# Altium schematic sheet Power.SchDoc: Power Management (part 1 of 3)
size Letter; Author: Parth Thakkar; CompanyName: Insane Corp; Organization: Low Self Esteam; Revision: v1.0; SheetNumber: 5; SheetTotal: 8
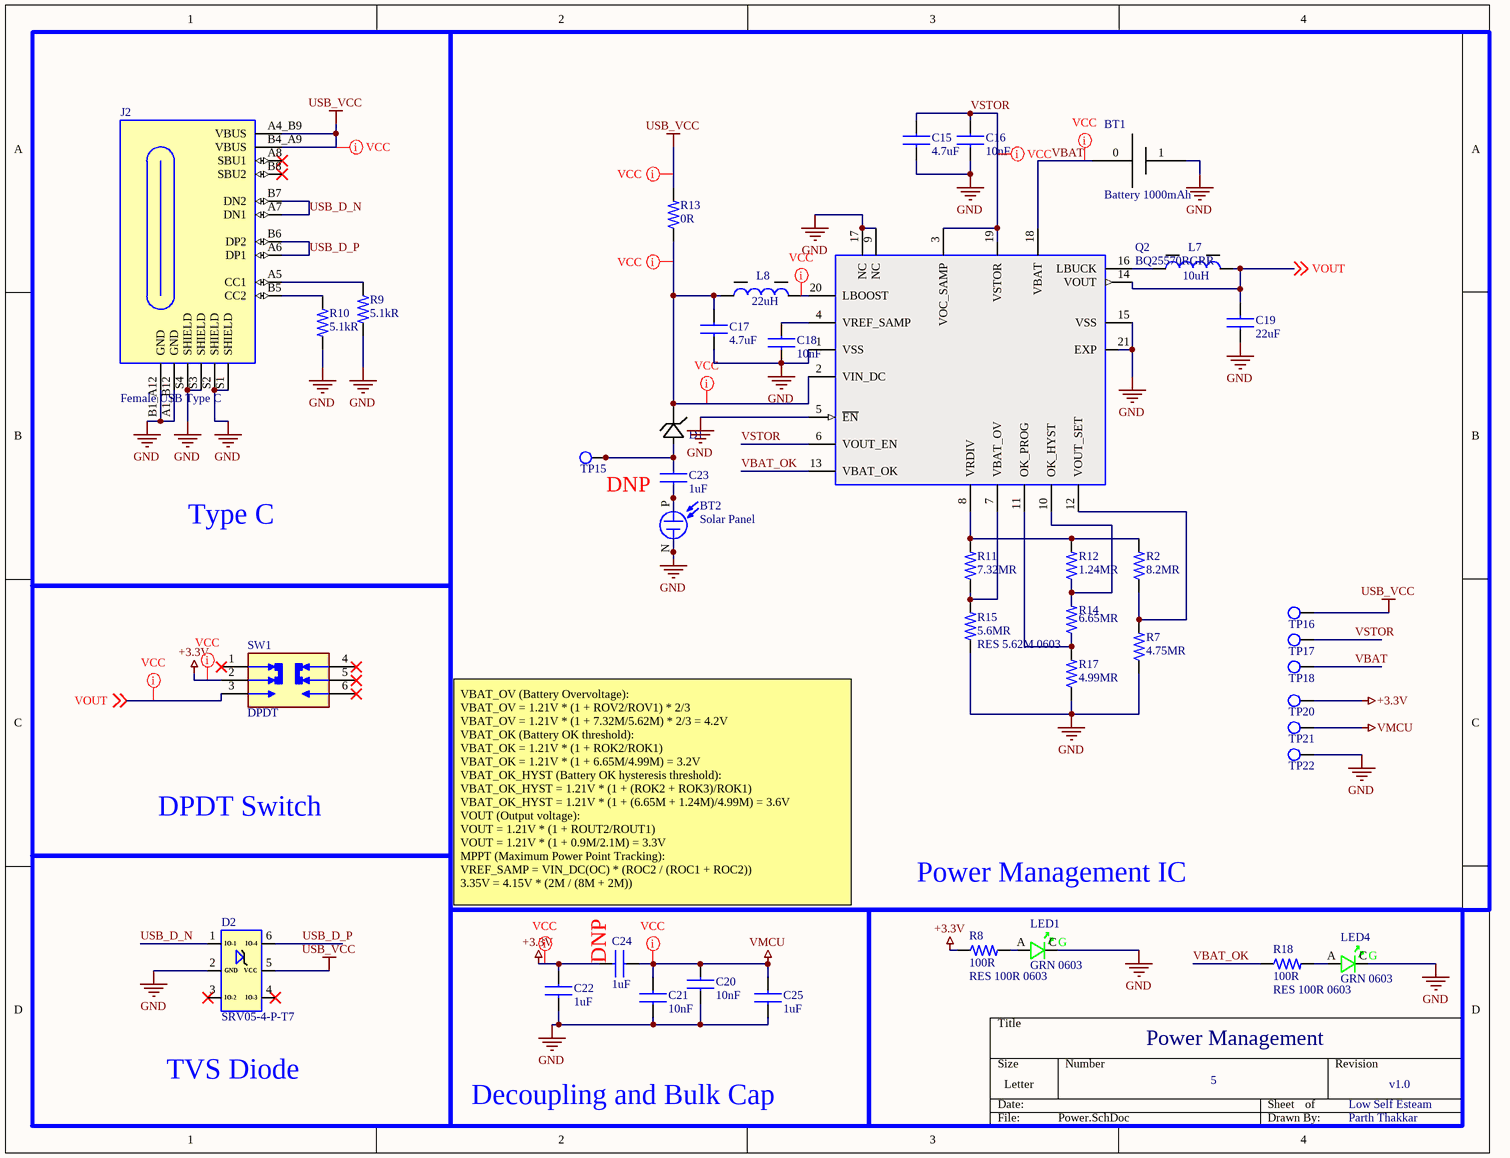
[diagram p0: Power.SchDoc]

## Parts
BT1  Battery 1000mAh  [Battery]
BT2  Solar Panel  [Solar panel]
C15  value 4.7uF  [Capacitor 0603]  (hidden comment: CAP 4.7uF 25V 0603)
C16  value 10nF  [Capacitor 0603]  (hidden comment: CAP 10nF 100V 0603)
C17  value 4.7uF  [Capacitor 0603]  (hidden comment: CAP 4.7uF 25V 0603)
C18  value 10nF  [Capacitor 0603]  (hidden comment: CAP 10nF 100V 0603)
C19  value 22uF  [Capacitor 0603]  (hidden comment: 22uF 10V X5R 0603)
C20  value 10nF  [Capacitor 0603]  (hidden comment: CAP 0.1uF 100V 0603)
C21  value 10nF  [Capacitor 0603]  (hidden comment: CAP 0.1uF 100V 0603)
C22  value 1uF  [CAPACITOR 0805]  (hidden comment: CAP 47uF 10V 0805)
C23  value 1uF  [CAPACITOR 0805]  (hidden comment: CAP 47uF 10V 0805)
C24  value 1uF  [CAPACITOR 0805]  (hidden comment: CAP 47uF 10V 0805)
C25  value 1uF  [CAPACITOR 0805]  (hidden comment: CAP 47uF 10V 0805)
D1  Diode Schottky  [Diode Schottky]  (value not drawn)
D2  SRV05-4-P-T7  [TVS]
J2  Female USB Type C  [Type C]
L7  Inductance-Nom (L): 10uH  [IND 10uH (1x3.2)]  (hidden comment: IND 10uH 1111)
L8  Inductance-Nom (L): 22uH  [IND 22uH (1.6x4.3)]  (hidden comment: IND 22uH 1515)
LED1  GRN 0603  [LED 0603]
LED4  GRN 0603  [LED 0603]
Q2  BQ25570RGRR  [BQ25570RGRR]
R2  value 8.2MR  [Resistor 0603]  (hidden comment: RES 8.2M 0603)
R7  value 4.75MR  [Resistor 0603]  (hidden comment: RES 4.75M 0603)
R8  RES 100R 0603  value 100R  [Resistor 0603]
R9  value 5.1kR  [Resistor 0603]  (hidden comment: RES 5.1K 0603)
R10  value 5.1kR  [Resistor 0603]  (hidden comment: RES 5.1K 0603)
R11  value 7.32MR  [Resistor 0603]  (hidden comment: RES 7.32M 0603)
R12  value 1.24MR  [Resistor 0603]  (hidden comment: RES 1.24M 0603)
R13  value 0R  [Resistor 0402]  (hidden comment: RES 0R 0402)
R14  value 6.65MR  [Resistor 0603]  (hidden comment: RES 6.65M 0603)
R15  RES 5.62M 0603  value 5.6MR  [Resistor 0603]
R17  value 4.99MR  [Resistor 0603]  (hidden comment: RES 4.99M 0603)
R18  RES 100R 0603  value 100R  [Resistor 0603]
SW1  DPDT  [DPDT]
TP15  Test point  [Test Point]  (value not drawn)  (net tie, no BOM)
TP16  Test point  [Test Point]  (value not drawn)  (net tie, no BOM)
TP17  Test point  [Test Point]  (value not drawn)  (net tie, no BOM)
TP18  Test point  [Test Point]  (value not drawn)  (net tie, no BOM)
TP20  Test point  [Test Point]  (value not drawn)  (net tie, no BOM)
TP21  Test point  [Test Point]  (value not drawn)  (net tie, no BOM)
TP22  Test point  [Test Point]  (value not drawn)  (net tie, no BOM)

## Blocks framed on the sheet
Type C: J2 R9 R10
Power Management IC: BT1 BT2 C15-C19 C23 D1 L7 L8 Q2 R2 R7 R11-R15 R17 TP15-TP18 TP20-TP22
DPDT Switch: SW1
TVS Diode: D2
Decoupling and Bulk Cap: C20-C22 C24 C25

## Nets
+3.3V: C22.1 C24.1 R8.1 SW1.2 TP20.1
GND: BT1.1(GND) BT2.N C15.2 C16.2 C17.2 C18.1 C19.2 C20.2 C21.2 C22.2 C25.2 D2.2(GND) J2.A1_B12(GND) J2.B1_A12(GND) J2.S1(SHIELD) J2.S2(SHIELD) J2.S3(SHIELD) J2.S4(SHIELD) LED1.C LED4.C Q2.1(VSS) Q2.5(~{EN}) Q2.9(NC) Q2.15(VSS) Q2.17(NC) Q2.21(EXP) R7.1 R9.2 R10.2 R15.1 R17.1 TP22.1
USB_VCC: D2.5(VCC) J2.A4_B9(VBUS) J2.B4_A9(VBUS) R13.2 TP16.1
VMCU: C20.1 C21.1 C24.2 C25.1 TP21.1
USB_D_N: D2.1(IO-1) J2.A7(DN1) J2.B7(DN2)
USB_D_P: D2.6(IO-4) J2.A6(DP1) J2.B6(DP2)
VBAT: BT1.0(VCC) Q2.18(VBAT) TP18.1
VBAT_OK: Q2.13(VBAT_OK) R18.1
VOUT: C19.1 L7.2 Q2.14(VOUT) SW1.3 ; off-sheet VOUT
VSTOR: C15.1 C16.1 Q2.3(VOC_SAMP) Q2.6(VOUT_EN) Q2.19(VSTOR) TP17.1
NetBT2_P: BT2.P C23.2
NetC17_1: C17.1 D1.3 L8.1 Q2.2(VIN_DC) R13.1
NetC18_2: C18.2 Q2.4(VREF_SAMP)
NetC23_1: C23.1 D1.1 TP15.1
NetJ2_A5: J2.A5(CC1) R9.1
NetJ2_B5: J2.B5(CC2) R10.1
NetL7_1: L7.1 Q2.16(LBUCK)
NetL8_2: L8.2 Q2.20(LBOOST)
NetLED1_A: LED1.A R8.2
NetLED4_A: LED4.A R18.2
NetQ2_7: Q2.7(VBAT_OV) R11.1 R15.2
NetQ2_8: Q2.8(VRDIV) R2.2 R11.2 R12.2
NetQ2_10: Q2.10(OK_HYST) R12.1 R14.2
NetQ2_11: Q2.11(OK_PROG) R14.1 R17.2
NetQ2_12: Q2.12(VOUT_SET) R2.1 R7.2

Not connected (* = marked no-connect by the designer): D2 3(IO-2)* 4(IO-3)*; J2 A8(SBU1)* B8(SBU2)*; SW1 1* 4* 5* 6*

## Layout directives
rule Width Constraint [Pref Width = 20mil    Min Width = 6mil    Max Width = 50mil]: VOUT
rule Width Constraint [Pref Width = 20mil    Min Width = 6mil    Max Width = 20mil]: +3.3V, NetC17_1, NetL8_2, USB_VCC, VBAT, VMCU, VSTOR

## Notes on the sheet
- DNP
- VBAT_OV (Battery Overvoltage):
  VBAT_OV = 1.21V * (1 + ROV2/ROV1) * 2/3
  VBAT_OV = 1.21V * (1 + 7.32M/5.62M) * 2/3 = 4.2V
  VBAT_OK (Battery OK threshold):
  VBAT_OK = 1.21V * (1 + ROK2/ROK1)
  VBAT_OK = 1.21V * (1 + 6.65M/4.99M) = 3.2V
  VBAT_OK_HYST (Battery OK hysteresis threshold):
  VBAT_OK_HYST = 1.21V * (1 + (ROK2 + ROK3)/ROK1)
  VBAT_OK_HYST = 1.21V * (1 + (6.65M + 1.24M)/4.99M) = 3.6V
  VOUT (Output voltage):
  VOUT = 1.21V * (1 + ROUT2/ROUT1)
  VOUT = 1.21V * (1 + 0.9M/2.1M) = 3.3V
  MPPT (Maximum Power Point Tracking):
  VREF_SAMP = VIN_DC(OC) * (ROC2 / (ROC1 + ROC2))
  3.35V = 4.15V * (2M / (8M + 2M))
- (near C24) DNP
- (in symbol LED Green 0603) G